# Altium schematic sheet LTM8074neg_PA.SchDoc: FMC SDR Frontend
size 420 x 297 mm; CheckedBy: -; CompanyName: CERN; DrawnBy: DrawnBy; Organization: CERN; Address1: European Organization for Nuclear Research; Address2: CH-1211 Genčve 23 - Switzerland; Revision: -; SheetNumber: -; SheetTotal: -; EDA_Number: EDA-XXXXX-VX-X; Projet: -; ModifiedBy: -; CreateDate: XX/XX/XXXX; CheckedDate: -; Title2: LTM874 - negative, PA GND; DivGrp: TE/MPE; Designer: Designer; ModifiedDate: -
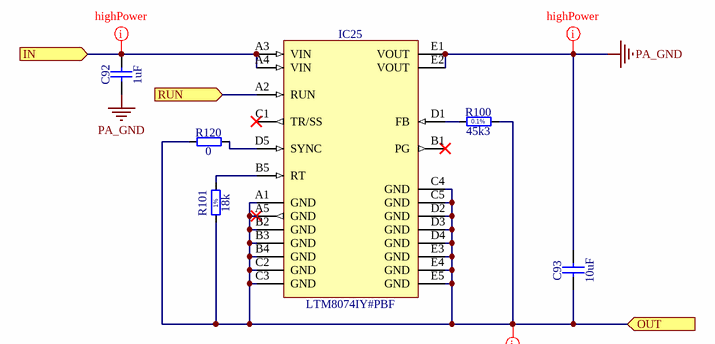
[diagram p0: LTM8074neg_PA.SchDoc]

## Parts
C92  1uF  [CAPC2012X110N]
C93  10uF  [CAPC2012X95N]
IC25  LTM8074IY#PBF  [BGA25C65P5X5_400X400X198]
R100  45k3  [RESC1608X55N]
R101  18k  [RESC1608X55N]
R120  0  [RESC1608X55N]

## Ports
IN (in), OUT (in), RUN (in)

## Nets
PA_GND: C92.1 C93.2 IC25.E1(VOUT) IC25.E2(VOUT)
IN: C92.2 IC25.A3(VIN) IC25.A4(VIN) ; port IN
OUT: C93.1 IC25.A1(GND) IC25.A5(GND) IC25.B2(GND) IC25.B3(GND) IC25.B4(GND) IC25.C2(GND) IC25.C3(GND) IC25.C4(GND) IC25.C5(GND) IC25.D2(GND) IC25.D3(GND) IC25.D4(GND) IC25.E3(GND) IC25.E4(GND) IC25.E5(GND) R100.2 R101.1 R120.1 ; port OUT
RUN: IC25.A2(RUN) ; port RUN
NetIC25_B5: IC25.B5(RT) R101.2
NetIC25_D1: IC25.D1(FB) R100.1
NetIC25_D5: IC25.D5(SYNC) R120.2

Not connected (* = marked no-connect by the designer): IC25 B1(PG)* C1(TR/SS)*

## Layout directives
net class highPower: IN, OUT, PA_GND

## Notes on the sheet
- Project/Equipment
- Document
- Designer
- Drawn by
- Check.by
- File
- Last Mod.
- Print Date
- Sheet
- Size
- A3
- of
- Rev
- (in symbol R0603_18K_1%_0.1W_100PPM) 1%
- (in symbol R0603_45K3_0.1%_0.063W_10PPM) 0.1%

## Library data of the parts
C92 = CC0805_1UF_50V_10%_X7R: Non-polarised capacitor; Part Description: SMD Multilayer Chip Ceramic Capacitor; Manufacturer: GENERIC; Manufacturer1 Part Number: C0805C105K5RACTU; Voltage: 50V; TC: X7R; Tolerance: ±10%; Part Number: CC0805_1UF_50V_10%_X7R; Component Kind: Standard; Component Type: Standard; Pin Count: 2; Value: 1uF; Status: Preferred; Manufacturer Part Number: CC0805_1UF_50V_10%_X7R; Case: 0805; Mounted: Yes; Socket: No; SMD: Yes; Sense: No; Manufacturer1 Example: KEMET; Manufacturer1 ComponentHeight: 1.1mm; HelpURL: \\cern.ch\dfs\Applications\Altium\Datasheets\CC0805_X7R_KEMET.pdf; Author: CERN DEM JLC; CreateDate: 04.12.2013; LatestRevisionDate: 04.12.2013
C93 = CC0805_10UF_25V_10%_X5R: Non-polarised capacitor; Part Description: SMD Multilayer Chip Ceramic Capacitor; Manufacturer: GENERIC; Manufacturer1 Part Number: GRM219R61E106KA12D; Voltage: 25V; TC: X5R; Tolerance: ±10%; Part Number: CC0805_10UF_25V_10%_X5R; Component Kind: Standard; Component Type: Standard; Pin Count: 2; Value: 10uF; Status: Preferred; Manufacturer Part Number: CC0805_10UF_25V_10%_X5R; Case: 0805; Mounted: Yes; Socket: No; SMD: Yes; Sense: No; Manufacturer1 Example: MURATA; Manufacturer1 ComponentHeight: 0.95mm; HelpURL: \\cern.ch\dfs\Applications\Altium\Datasheets\CC0805_X5R_MURATA_GRM.pdf; Author: CERN DEM JLC; CreateDate: 25.10.2012; LatestRevisionDate: 06.09.2016
IC25 = LTM8074IY#PBF: 40VIN, 1.2A Silent Switcher µModule Regulator; Manufacturer: LINEAR TECHNOLOGY; PressFit: No; Bonding: No; Part Number: LTM8074IY#PBF; Component Kind: Standard; Component Type: Standard; Device: LTM8074IY#PBF; PackageDescription: BGA, 0.65mm Pitch, Square; 25 Pin, 5 Columns X 5 Rows, 4.00mm X 4.00mm X 1.98mm H; Part Description: 40VIN, 1.2A Silent Switcher µModule Regulator; Manufacturer Part Number: LTM8074IY#PBF; Pin Count: 25; Case: BGA25; Mounted: Yes; Socket: No; SMD: Yes; Sense: No; ComponentHeight: 1.98mm; HelpURL: \\cern.ch\dfs\Applications\Altium\Datasheets\LTM8074IY#PBF.pdf; Author: CERN DEM JLC; CreateDate: 08.04.2019; LatestRevisionDate: 08.04.2019
R100 = R0603_45K3_0.1%_0.063W_10PPM: Resistor - 0.1%; Part Description: Thin Film Chip Resistor; Manufacturer: GENERIC; Manufacturer1 Part Number: RN73C1J45K3BTDF; Power: 0.063W; TC: ±10ppm; PressFit: No; Part Number: R0603_45K3_0.1%_0.063W_10PPM; Component Kind: Standard; Component Type: Standard; Pin Count: 2; Value: 45k3; Status: Not Recommended; Tolerance: ±0.1%; Manufacturer Part Number: R0603_45K3_0.1%_0.063W_10PPM; Case: 0603; Mounted: Yes; Sense: No; Socket: No; SMD: Yes; Manufacturer1 Example: TYCO HOLSWORTHY; Manufacturer1 ComponentHeight: 0.5mm; HelpURL: \\cern.ch\dfs\Applications\Altium\Datasheets\R0603_Tyco_RN73.pdf; Author: CERN DEM JLC; CreateDate: 03.12.2007; LatestRevisionDate: 13.03.2008
R101 = R0603_18K_1%_0.1W_100PPM: Resistor - 1%; Part Description: General Purpose Thick Film Chip Resistor; Manufacturer: GENERIC; Manufacturer1 Part Number: NRC06F1802TRF; Power: 0.1W; TC: ±100ppm/°C; PressFit: No; Part Number: R0603_18K_1%_0.1W_100PPM; Component Kind: Standard; Component Type: Standard; Pin Count: 2; Value: 18k; Status: Preferred; Tolerance: ±1%; Manufacturer Part Number: R0603_18K_1%_0.1W_100PPM; Case: 0603; Mounted: Yes; Sense: No; Socket: No; SMD: Yes; Manufacturer1 Example: NIC COMPONENT; Manufacturer1 ComponentHeight: 0.55mm; HelpURL: \\cern.ch\dfs\Applications\Altium\Datasheets\R0603_NIC_NRC.pdf; Author: CERN DEM JLC; CreateDate: 03.12.2007; LatestRevisionDate: 13.03.2008
R120 = R0603_0R_JUMPER: Resistor; Part Description: 1A (0.05R Max DC Resistance) Zero Ohm Jumper; Manufacturer: GENERIC; Manufacturer1 Part Number: NRC06Z0; PressFit: No; Part Number: R0603_0R_JUMPER; Component Kind: Standard; Component Type: Standard; Pin Count: 2; Value: 0; Status: Preferred; Manufacturer Part Number: R0603_0R_JUMPER; Case: 0603; Mounted: Yes; Sense: No; Socket: No; SMD: Yes; Manufacturer1 Example: NIC COMPONENT; Manufacturer1 ComponentHeight: 0.55mm; HelpURL: \\cern.ch\dfs\Applications\Altium\Datasheets\R0603_NIC_NRC.pdf; Author: CERN DEM JLC; CreateDate: 03.12.2007; LatestRevisionDate: 13.03.2008